# Altium schematic sheet uart.SchDoc
size A3
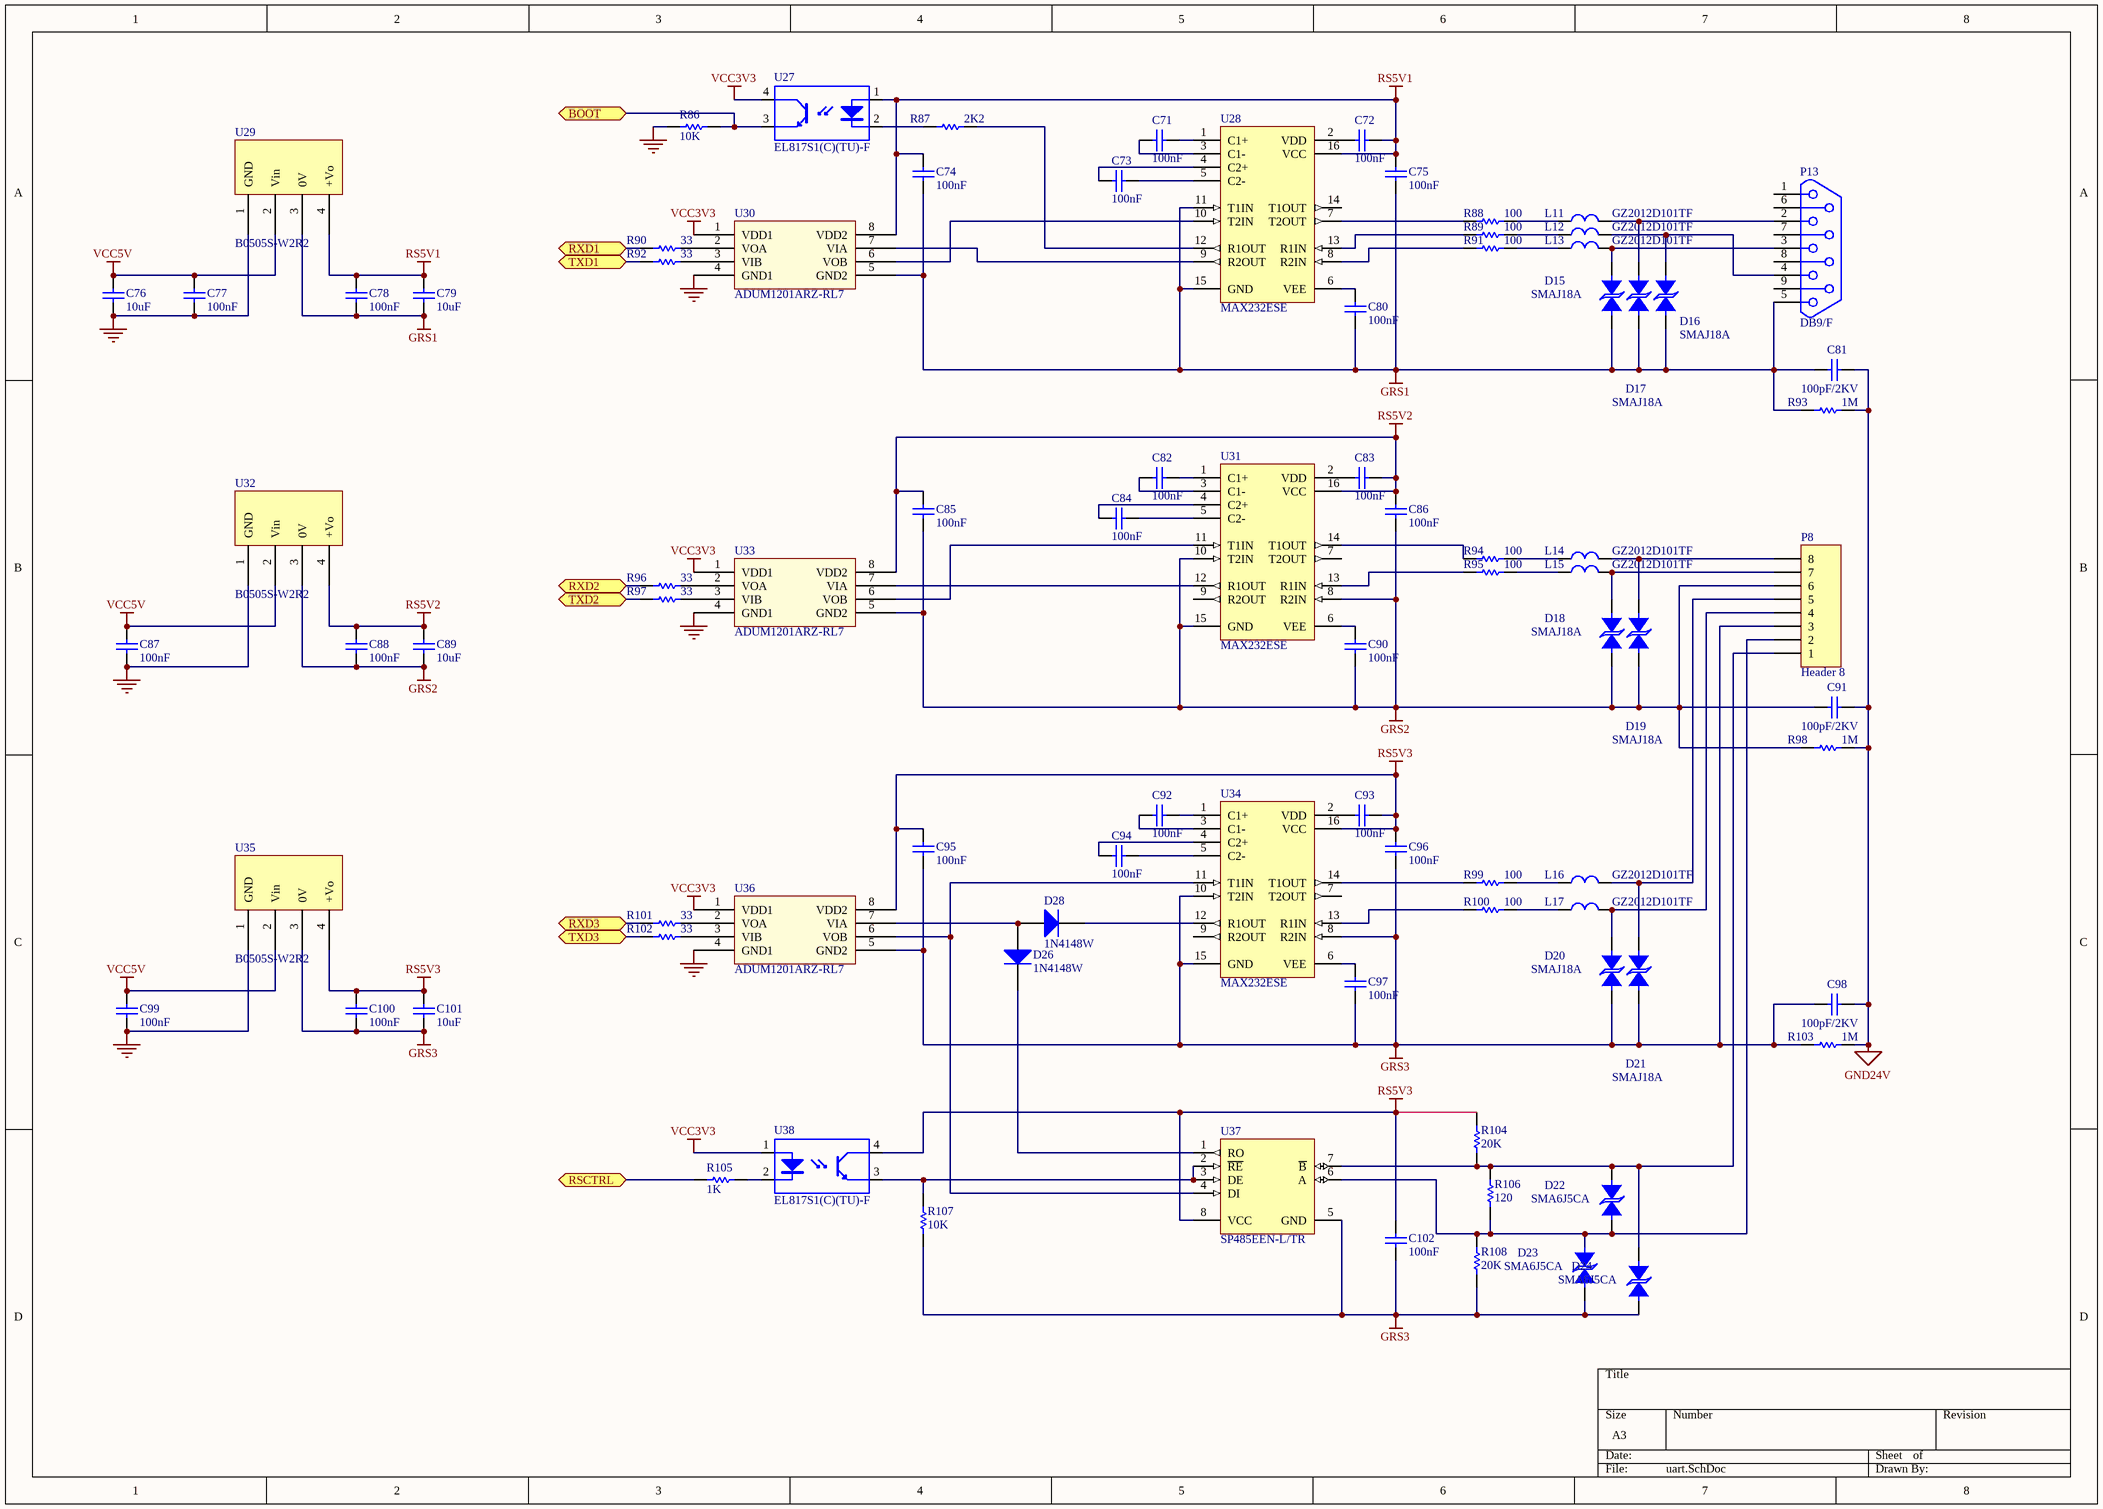
[diagram p0: uart.SchDoc]

## Parts
C71  100nF  [0805_C]
C72  100nF  [0805_C]
C73  100nF  [0805_C]
C74  100nF  [0805_C]
C75  100nF  [0805_C]
C76  10uF  [0805_C]
C77  100nF  [0805_C]
C78  100nF  [0805_C]
C79  10uF  [0805_C]
C80  100nF  [0805_C]
C81  100pF/2KV  [1206_C]
C82  100nF  [0805_C]
C83  100nF  [0805_C]
C84  100nF  [0805_C]
C85  100nF  [0805_C]
C86  100nF  [0805_C]
C87  100nF  [0805_C]
C88  100nF  [0805_C]
C89  10uF  [0805_C]
C90  100nF  [0805_C]
C91  100pF/2KV  [1206_C]
C92  100nF  [0805_C]
C93  100nF  [0805_C]
C94  100nF  [0805_C]
C95  100nF  [0805_C]
C96  100nF  [0805_C]
C97  100nF  [0805_C]
C98  100pF/2KV  [1206_C]
C99  100nF  [0805_C]
C100  100nF  [0805_C]
C101  10uF  [0805_C]
C102  100nF  [0805_C]
D15  SMAJ18A  [SMA]
D16  SMAJ18A  [SMA]
D17  SMAJ18A  [SMA]
D18  SMAJ18A  [SMA]
D19  SMAJ18A  [SMA]
D20  SMAJ18A  [SMA]
D21  SMAJ18A  [SMA]
D22  SMA6J5CA  [SMA]
D23  SMA6J5CA  [SMA]
D24  SMA6J5CA  [SMA]
D26  1N4148W  [SOD-123]
D28  1N4148W  [SOD-123]
L11  GZ2012D101TF  [0805_L]
L12  GZ2012D101TF  [0805_L]
L13  GZ2012D101TF  [0805_L]
L14  GZ2012D101TF  [0805_L]
L15  GZ2012D101TF  [0805_L]
L16  GZ2012D101TF  [0805_L]
L17  GZ2012D101TF  [0805_L]
P8  Header 8  [MC1.5/8-ST-3.81]
P13  DB9/F  [DB9P/F]
R86  10K  [0805_R]
R87  2K2  [0805_R]
R88  100  [0805_R]
R89  100  [0805_R]
R90  33  [0805_R]
R91  100  [0805_R]
R92  33  [0805_R]
R93  1M  [1206_R]
R94  100  [0805_R]
R95  100  [0805_R]
R96  33  [0805_R]
R97  33  [0805_R]
R98  1M  [1206_R]
R99  100  [0805_R]
R100  100  [0805_R]
R101  33  [0805_R]
R102  33  [0805_R]
R103  1M  [1206_R]
R104  20K  [0805_R]
R105  1K  [0805_R]
R106  120  [0805_R]
R107  10K  [0805_R]
R108  20K  [0805_R]
U27  EL817S1(C)(TU)-F  [LC-SMD-4]
U28  MAX232ESE  [SOIC-16_150mil]
U29  B0505S-W2R2  [MORNSUN-BM]
U30  ADUM1201ARZ-RL7  [SOIC-8_150mil]
U31  MAX232ESE  [SOIC-16_150mil]
U32  B0505S-W2R2  [MORNSUN-BM]
U33  ADUM1201ARZ-RL7  [SOIC-8_150mil]
U34  MAX232ESE  [SOIC-16_150mil]
U35  B0505S-W2R2  [MORNSUN-BM]
U36  ADUM1201ARZ-RL7  [SOIC-8_150mil]
U37  SP485EEN-L/TR  [SOIC-8_150mil]
U38  EL817S1(C)(TU)-F  [LC-SMD-4]

## Ports
BOOT, RSCTRL, RXD1, RXD2, RXD3, TXD1, TXD2, TXD3

## Nets
GND: C76.1 C77.2 C87.2 C99.2 R86.1 U29.1(GND) U30.4(GND1) U32.1(GND) U33.4(GND1) U35.1(GND) U36.4(GND1)
GND24V: C81.2 C91.2 C98.2 R93.2 R98.2 R103.2
GRS1: C74.2 C75.2 C78.2 C79.1 C80.1 C81.1 D15.1(ANODE) D16.1(ANODE) D17.1(ANODE) P13.5 R93.1 U28.11(T1IN) U28.15(GND) U29.3(0V) U30.5(GND2)
GRS2: C85.2 C86.2 C88.2 C89.1 C90.1 C91.1 D18.1(ANODE) D19.1(ANODE) P8.6 R98.1 U31.8(R2IN) U31.10(T2IN) U31.15(GND) U32.3(0V) U33.5(GND2)
GRS3: C95.2 C96.2 C97.1 C98.1 C100.2 C101.1 C102.1 D20.1(ANODE) D21.1(ANODE) D23.1(ANODE) D24.1(ANODE) P8.3 R103.1 R107.2 R108.2 U34.8(R2IN) U34.10(T2IN) U34.15(GND) U35.3(0V) U36.5(GND2) U37.5(GND)
RS5V1: C72.1 C74.1 C75.1 C78.1 C79.2 U27.1(A) U28.16(VCC) U29.4(+Vo) U30.8(VDD2)
RS5V2: C83.1 C85.1 C86.1 C88.1 C89.2 U31.16(VCC) U32.4(+Vo) U33.8(VDD2)
RS5V3: C93.1 C95.1 C96.1 C100.1 C101.2 C102.2 R104.1 U34.16(VCC) U35.4(+Vo) U36.8(VDD2) U37.8(VCC) U38.4(C)
VCC3V3: U27.4(C) U30.1(VDD1) U33.1(VDD1) U36.1(VDD1) U38.1(A)
VCC5V: C76.2 C77.1 C87.1 C99.1 U29.2(Vin) U32.2(Vin) U35.2(Vin)
BOOT: R86.2 U27.3(E) ; port BOOT
RSCTRL: R105.1 ; port RSCTRL
RXD1: R90.1 ; port RXD1
RXD2: R96.1 ; port RXD2
RXD3: R101.1 ; port RXD3
TXD1: R92.2 ; port TXD1
TXD2: R97.2 ; port TXD2
TXD3: R102.2 ; port TXD3
NetC71_1: C71.1 U28.1(C1+)
NetC71_2: C71.2 U28.3(C1-)
NetC72_2: C72.2 U28.2(VDD)
NetC73_1: C73.1 U28.5(C2-)
NetC73_2: C73.2 U28.4(C2+)
NetC80_2: C80.2 U28.6(VEE)
NetC82_1: C82.1 U31.1(C1+)
NetC82_2: C82.2 U31.3(C1-)
NetC83_2: C83.2 U31.2(VDD)
NetC84_1: C84.1 U31.5(C2-)
NetC84_2: C84.2 U31.4(C2+)
NetC90_2: C90.2 U31.6(VEE)
NetC92_1: C92.1 U34.1(C1+)
NetC92_2: C92.2 U34.3(C1-)
NetC93_2: C93.2 U34.2(VDD)
NetC94_1: C94.1 U34.5(C2-)
NetC94_2: C94.2 U34.4(C2+)
NetC97_2: C97.2 U34.6(VEE)
NetD15_2: D15.2(CATHODE) L13.2 P13.3
NetD16_2: D16.2(CATHODE) L12.2 P13.4
NetD17_2: D17.2(CATHODE) L11.2 P13.2
NetD18_2: D18.2(CATHODE) L15.2 P8.7
NetD19_2: D19.2(CATHODE) L14.2 P8.8
NetD20_2: D20.2(CATHODE) L17.2 P8.4
NetD21_2: D21.2(CATHODE) L16.2 P8.5
NetD22_1: D22.1(ANODE) D23.2(CATHODE) P8.2 R106.2 R108.1 U37.6(A)
NetD22_2: D22.2(CATHODE) D24.2(CATHODE) P8.1 R104.2 R106.1 U37.7(~{B})
NetD26_1: D26.1(A) D28.1(A) U36.7(VIA)
NetD26_2: D26.2(K) U37.1(RO)
NetD28_2: D28.2(K) U34.12(R1OUT)
NetL11_1: L11.1 R88.1
NetL12_1: L12.1 R89.1
NetL13_1: L13.1 R91.1
NetL14_1: L14.1 R94.1
NetL15_1: L15.1 R95.1
NetL16_1: L16.1 R99.1
NetL17_1: L17.1 R100.1
NetR87_1: R87.1 U27.2(K)
NetR87_2: R87.2 U28.12(R1OUT)
NetR88_2: R88.2 U28.7(T2OUT)
NetR89_2: R89.2 U28.13(R1IN)
NetR90_2: R90.2 U30.2(VOA)
NetR91_2: R91.2 U28.8(R2IN)
NetR92_1: R92.1 U30.3(VIB)
NetR94_2: R94.2 U31.14(T1OUT)
NetR95_2: R95.2 U31.13(R1IN)
NetR96_2: R96.2 U33.2(VOA)
NetR97_1: R97.1 U33.3(VIB)
NetR99_2: R99.2 U34.14(T1OUT)
NetR100_2: R100.2 U34.13(R1IN)
NetR101_2: R101.2 U36.2(VOA)
NetR102_1: R102.1 U36.3(VIB)
NetR105_2: R105.2 U38.2(K)
NetR107_1: R107.1 U37.2(~{RE}) U37.3(DE) U38.3(E)
NetU28_9: U28.9(R2OUT) U30.7(VIA)
NetU28_10: U28.10(T2IN) U30.6(VOB)
NetU31_11: U31.11(T1IN) U33.6(VOB)
NetU31_12: U31.12(R1OUT) U33.7(VIA)
NetU34_11: U34.11(T1IN) U36.6(VOB) U37.4(DI)

Not connected (* = marked no-connect by the designer): P13 1 6 7 8 9; U28 14(T1OUT); U31 7(T2OUT) 9(R2OUT); U34 7(T2OUT) 9(R2OUT)

## Library data of the parts
C71-C75 C77 C78 C80 C82-C88 C90 C92-C97 C99 C100 C102 = 0805 100nF(104) 10% 50V: 贴片电容; ComponentLink1Description: 供应商链接; ComponentLink1URL: http://www.szlcsc.com/product/details_50686.html; Package: 0805; Supplier: LC; SuppliersPartNumber: C49678
C76 C79 C89 C101 = 0805 10uF (106) 10% 25V: 贴片电容; ComponentLink1Description: 供应商链接; ComponentLink1URL: http://www.szlcsc.com/product/details_16532.html; Package: 0805; Supplier: LC; SuppliersPartNumber: C15850
C81 C91 C98 = Cap: Capacitor; Value: 100nF; Published: 8-Jun-2000; LatestRevisionDate: 17-Jul-2002; LatestRevisionNote: Re-released for DXP Platform.; PackageReference: RAD-0.3; Publisher: Altium Limited
D15-D24 = Bidirectional DIODE TVS: 1V5KE6V8CA
D26 D28 = Diode: Default Diode; Published: 8-Jun-2000; LatestRevisionDate: 17-Jul-2002; LatestRevisionNote: Re-released for DXP Platform.; PackageVersion: Sep-1996; PackageReference: SMC; Publisher: Altium Limited; Code_JEDEC: DO-214-AB
L11-L17 = L1
P8 = Header 8: Header, 8-Pin; LatestRevisionDate: 17-Jul-2002; LatestRevisionNote: Re-released for DXP Platform.; Publisher: Altium Limited
P13 = DB9
R86 R88 R89 R91 R94 R95 R99 R100 R104-R108 = Res1: Resistor; Value: 330; Published: 8-Jun-2000; LatestRevisionDate: 17-Jul-2002; LatestRevisionNote: Re-released for DXP Platform.; PackageReference: AXIAL-0.3; Publisher: Altium Limited
R87 R90 R93 R96 R98 R101 R103 = Res1: Resistor; Value: 5.1K; Published: 8-Jun-2000; LatestRevisionDate: 17-Jul-2002; LatestRevisionNote: Re-released for DXP Platform.; PackageReference: AXIAL-0.3; Publisher: Altium Limited
R92 R97 R102 = Res1: Resistor; Value: 10K; Published: 8-Jun-2000; LatestRevisionDate: 17-Jul-2002; LatestRevisionNote: Re-released for DXP Platform.; PackageReference: AXIAL-0.3; Publisher: Altium Limited
U27 U38 = TLP521: Text Field1: 80; Text Field2: 50
U28 U31 U34 = MAX232ESE_[C26860]: RS232; ComponentLink1Description: 供应商链接; ComponentLink1URL: http://www.szlcsc.com/product/details_27608.html; Package: SOIC-16_150mil; Supplier: LC; SuppliersPartNumber: C26860
U29 U32 U35 = MORNSUN-BM: MORNSUN Fixed input,Isolated,Unregulated Series DC/DC
U30 U33 U36 = ADUM1201ARZ-RL7_[C9669]: 隔离器; ComponentLink1Description: 供应商链接; ComponentLink1URL: http://www.szlcsc.com/product/details_10199.html; Package: SOIC-8_150mil; Supplier: LC; SuppliersPartNumber: C9669
U37 = SP485EEN-L/TR_[C6855]: RS-485/RS-422; ComponentLink1Description: 供应商链接; ComponentLink1URL: http://www.szlcsc.com/product/details_7327.html; Package: SOIC-8; Supplier: LC; SuppliersPartNumber: C6855